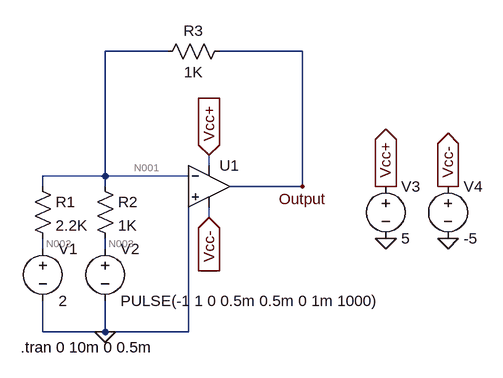
[diagram p0: schematic Draft1.asc]
Draft1.asc, the LTspice schematic file:
Version 4
SHEET 1 880 680
WIRE 192 -144 96 -144
WIRE 400 -144 272 -144
WIRE 256 32 256 16
WIRE 96 48 96 -144
WIRE 96 48 0 48
WIRE 224 48 96 48
WIRE 0 64 0 48
WIRE 96 64 96 48
WIRE 400 64 400 -144
WIRE 400 64 288 64
WIRE 256 112 256 96
WIRE 0 160 0 144
WIRE 96 160 96 144
WIRE 0 288 0 240
WIRE 96 288 96 240
WIRE 96 288 0 288
WIRE 224 288 224 80
WIRE 224 288 96 288
FLAG 256 16 Vcc+
IOPIN 256 16 In
FLAG 256 112 Vcc-
IOPIN 256 112 In
FLAG 528 64 Vcc+
IOPIN 528 64 Out
FLAG 624 64 Vcc-
IOPIN 624 64 Out
FLAG 96 288 0
FLAG 528 144 0
FLAG 624 144 0
FLAG 400 64 Output
SYMBOL Opamps\\UniversalOpamp2 256 64 R0
SYMATTR InstName U1
SYMBOL res -16 48 R0
SYMATTR InstName R1
SYMATTR Value 2.2K
SYMBOL res 80 48 R0
SYMATTR InstName R2
SYMATTR Value 1K
SYMBOL res 288 -160 R90
WINDOW 0 0 56 VBottom 2
WINDOW 3 32 56 VTop 2
SYMATTR InstName R3
SYMATTR Value 1K
SYMBOL voltage 0 144 R0
WINDOW 123 0 0 Left 0
WINDOW 39 0 0 Left 0
SYMATTR InstName V1
SYMATTR Value 2
SYMBOL voltage 96 144 R0
WINDOW 123 0 0 Left 0
WINDOW 39 0 0 Left 0
SYMATTR InstName V2
SYMATTR Value PULSE(-1 1 0 0.5m 0.5m 0 1m 1000)
SYMBOL voltage 528 48 R0
WINDOW 123 0 0 Left 0
WINDOW 39 0 0 Left 0
SYMATTR InstName V3
SYMATTR Value 5
SYMBOL voltage 624 48 R0
WINDOW 123 0 0 Left 0
WINDOW 39 0 0 Left 0
SYMATTR InstName V4
SYMATTR Value -5
TEXT -34 312 Left 2 !.tran 0 10m 0 0.5m

The netlist it stands for:
* Draft1.asc
XU1 0 N001 Vcc+ Vcc- Output level.2 Avol=1Meg GBW=10Meg Slew=10Meg ilimit=25m rail=0 Vos=0 phimargin=45 en=0 enk=0 in=0 ink=0 Rin=500Meg  ; pins IN+ IN- V+ V- OUT
R1 N001 N002 2.2K
R2 N001 N003 1K
R3 Output N001 1K
V1 N002 0 2
V2 N003 0 PULSE(-1 1 0 0.5m 0.5m 0 1m 1000)
V3 Vcc+ 0 5
V4 Vcc- 0 -5
.tran 0 10m 0 0.5m
.lib UniversalOpamps2.sub
.backanno
.end

* Results of the author's LTspice run, read from the files saved beside the schematic
* Operating Point, zero values left out:
*   V(output) = 90.91 mV
*   V(vcc+) = 5 V
*   V(vcc-) = -5 V
*   V(n001) = -93.4 nV
*   V(n002) = 2 V
*   V(n003) = -1 V
*   I(R3) = 90.91 µA
*   I(R2) = 1 mA
*   I(R1) = -909.1 µA
*   I(V4) = 456.5 µA
*   I(V3) = -547.4 µA
*   I(V2) = 1 mA
*   I(V1) = -909.1 µA
*   Ix(u1:3) = 547.4 µA
*   Ix(u1:4) = -456.5 µA
*   Ix(u1:5) = -90.91 µA
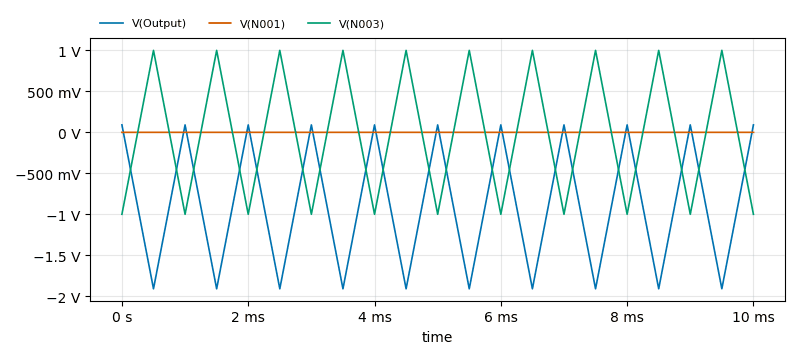
[diagram p1: Transient Analysis of Draft1.asc, plotted from the saved traces]
* Transient Analysis, 1 run:
*   V(Output): min -1.909 V, max 90.91 mV, average -909.1 mV, rms 1.104 V, last 90.75 mV
*   V(N001): min -66.14 µV, max 70.64 µV, average 333.1 nV, rms 64.36 µV, last -66.14 µV
*   V(N003): min -1 V, max 1 V, average 0 V, rms 625.8 mV, last -1 V